# EAGLE design untitled (EAGLE 9.4.2)
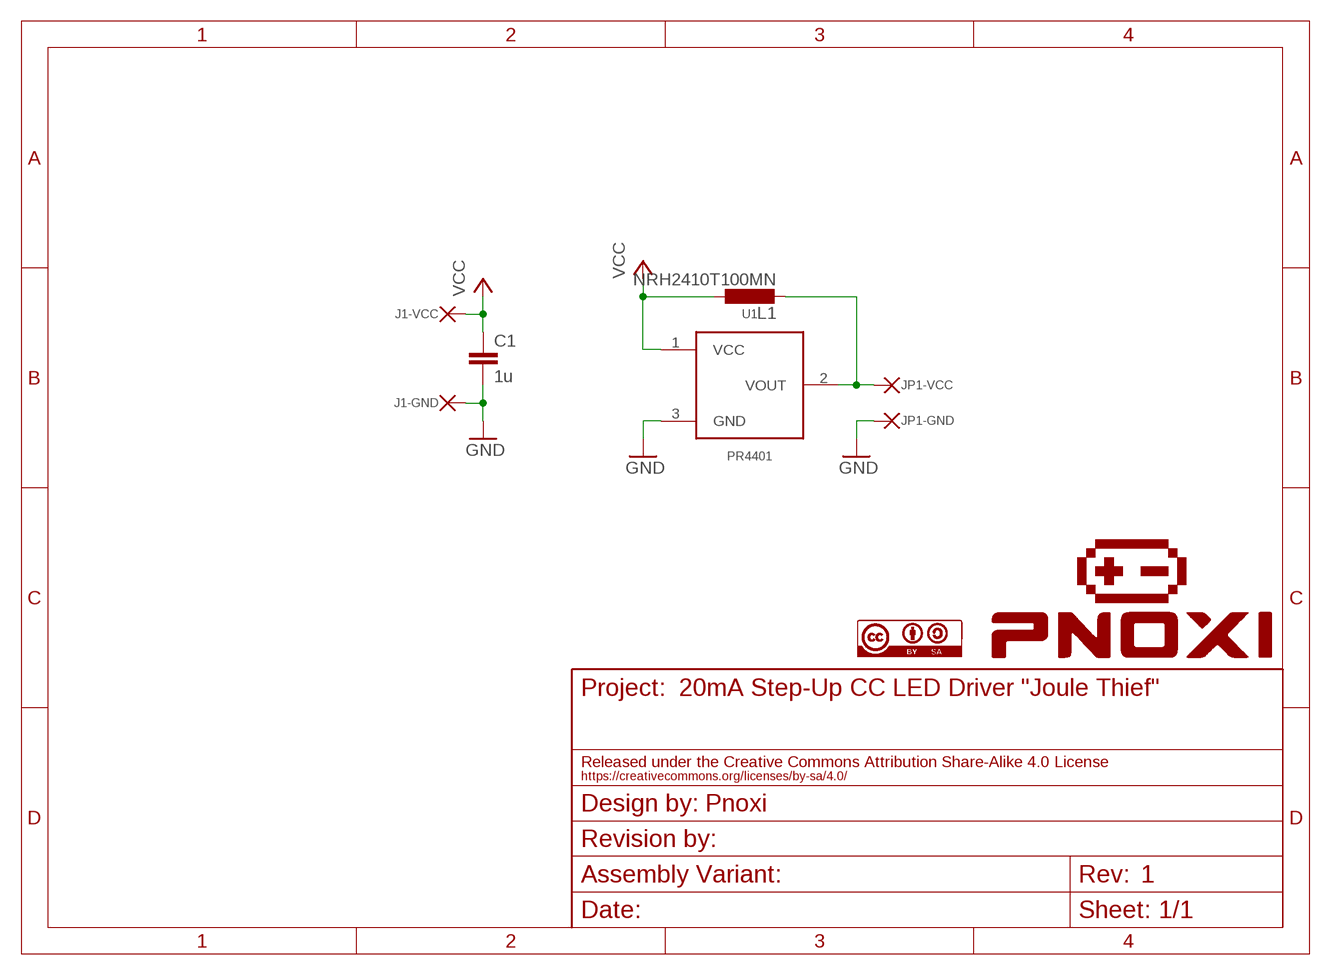
[diagram p0: schematic, sheet 1]
QUIT1 (A5L): DESIGNER: Pnoxi; PROJECT_NAME: 20mA Step-Up CC LED Driver "Joule Thief"; REV: 1

## Parts
C1  1u  C_EU_0603  [0603]
J1  SMD_PAD2  [SMD_PAD_2]
JP1  SMD_PAD2  [SMD_PAD_2]
L1  NRH2410T100MN  L_EU_WALSIN_2.4X2.4X1MM  [WALSIN_2.4X2.4X1MM]
U1  PR4401  ZXSC380FHTA  [SOT23-3]

## Nets
GND: C1.2 J1.GND J1.GND1 J1.GND2 J1.GND3 JP1.GND JP1.GND1 JP1.GND2 JP1.GND3 U1.3(GND)
N$2: JP1.VCC JP1.VCC1 JP1.VCC2 JP1.VCC3 L1.P$2 U1.2(VOUT)
VCC: C1.1 J1.VCC J1.VCC1 J1.VCC2 J1.VCC3 L1.P$1 U1.1(VCC)

## Library data of the parts
C1 = Emsit-Passives:C_EU
J1 JP1 = CC_driver_5mm_LED:SMD_PAD
L1 = Emsit-Passives:L_EU_; PACKAGE: 242410/242415
U1 = Emsit-AnalogIC:ZXSC380

## Net classes
0 default: clearance 0.205 mm

## Board
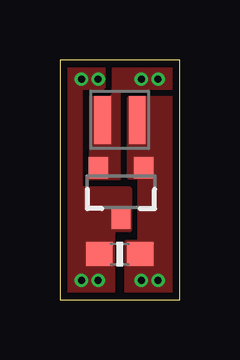
[diagram p1: board, top side]
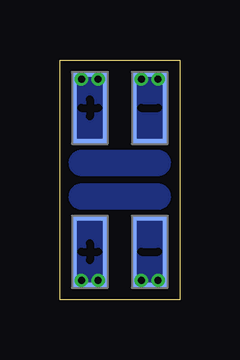
[diagram p2: board, bottom side, seen from below]

Size 5 x 10 mm. Coordinates in mm from the lower left corner, seen from the top.
Outline: 0,0 5,0 5,10 0,10 0,0
Copper layers (1*16): Top 0.035559375mm / dielectric 1.6mm / Bottom 0.035559375mm
Design rules "oshpark-2layer *": minimum track width 6mil, minimum drill 10mil, track to track 6mil, track to pad 6mil, pad to pad 6mil, via to via 6mil, smd to smd 6mil, copper to edge 12mil, drill to drill 6mil, minimum pad ring 5mil, minimum via ring 5mil, stop-mask expansion 2.5mil, vias tented up to drill 0.5mm, thermal gap 8mil

### Footprints (pad centres in the part's own frame; a part is rotated, then mirrored left to right if it is on the bottom)
0603 = smd 1.1 x 1: 1 -0.85,0; 2 0.85,0
SMD_PAD_2 = smd 1.5 x 0.2 bottom: GND -1.25,-1.4; GND2 -1.25,1.4; VCC 1.25,-1.4; VCC2 1.25,1.4 | smd 0.2 x 2.6 bottom: GND1 -0.6,0; GND3 -1.9,0; VCC1 1.9,0; VCC3 0.6,0
WALSIN_2.4X2.4X1MM = smd 0.7 x 2: P$1 -0.725,0; P$2 0.725,0
SOT23-3 = smd 0.8 x 0.9: 1 -0.95,-1; 2 0.95,-1; 3 0,1.1

### Placement (x,y rotation side)
C1  2.5,1.9 180 top
J1  2.5,2 0 top
JP1  2.5,8 0 top
L1  2.5,7.5 180 top
U1  2.55,4.5 180 top

### Tracks (layer width: path | path; a pad name or v marks a point on that pad's centre or on a via)
GND  (via drill 0.3)
  other vias: 0.9,0.8 1.6,0.8 0.9,9.2 1.6,9.2
  pour Bottom (isolate 0.102, no thermals): 0.5,9.5 2,9.5 2,6.5 0.5,6.5
  pour Bottom (isolate 0.102, no thermals): 0.5,3.5 2,3.5 2,0.5 0.5,0.5
  pour Top (isolate 0.254, no thermals): 0,0 0,10 1.8,10 1.8,8.85 0.84,8.85 0.84,4.63 2.9,4.63 2.9,2.9 2.2,2.9 2.2,0
N$2  (via drill 0.3)
  other vias: 3.4,9.2 4.1,9.2
  pour Bottom (isolate 0.102, no thermals): 3,9.5 4.5,9.5 4.5,6.5 3,6.5
  pour Top (isolate 0.254, rank 2, no thermals): 1.2,8.57 1.2,5.1 2.5,5.1 2.5,8.7 5,8.7 5,10 2.2,10 2.2,8.57
N$3
  pour Bottom (isolate 0.102, rank 6, no thermals): 4.1,4.8 arc-180 4.1,3.8 0.9,3.8 arc-180 0.9,4.8
N$4
  pour Bottom (isolate 0.102, rank 6, no thermals): 4.1,6.2 arc-180 4.1,5.2 0.9,5.2 arc-180 0.9,6.2
VCC  (via drill 0.3)
  other vias: 3.4,0.8 4.1,0.8
  pour Bottom (isolate 0.102, no thermals): 3,3.5 4.5,3.5 4.5,0.5 3,0.5
  pour Top (isolate 0.254, no thermals): 5,0 2.8,0 2.8,2.4 3.35,2.4 3.35,5.1 2.9,5.1 2.9,8.4 5,8.4

### Text on the board
bStop: +LED- | +INPUT-
tDocu: polarity mark